# EAGLE design Interface_BAT (EAGLE 9.6.2)
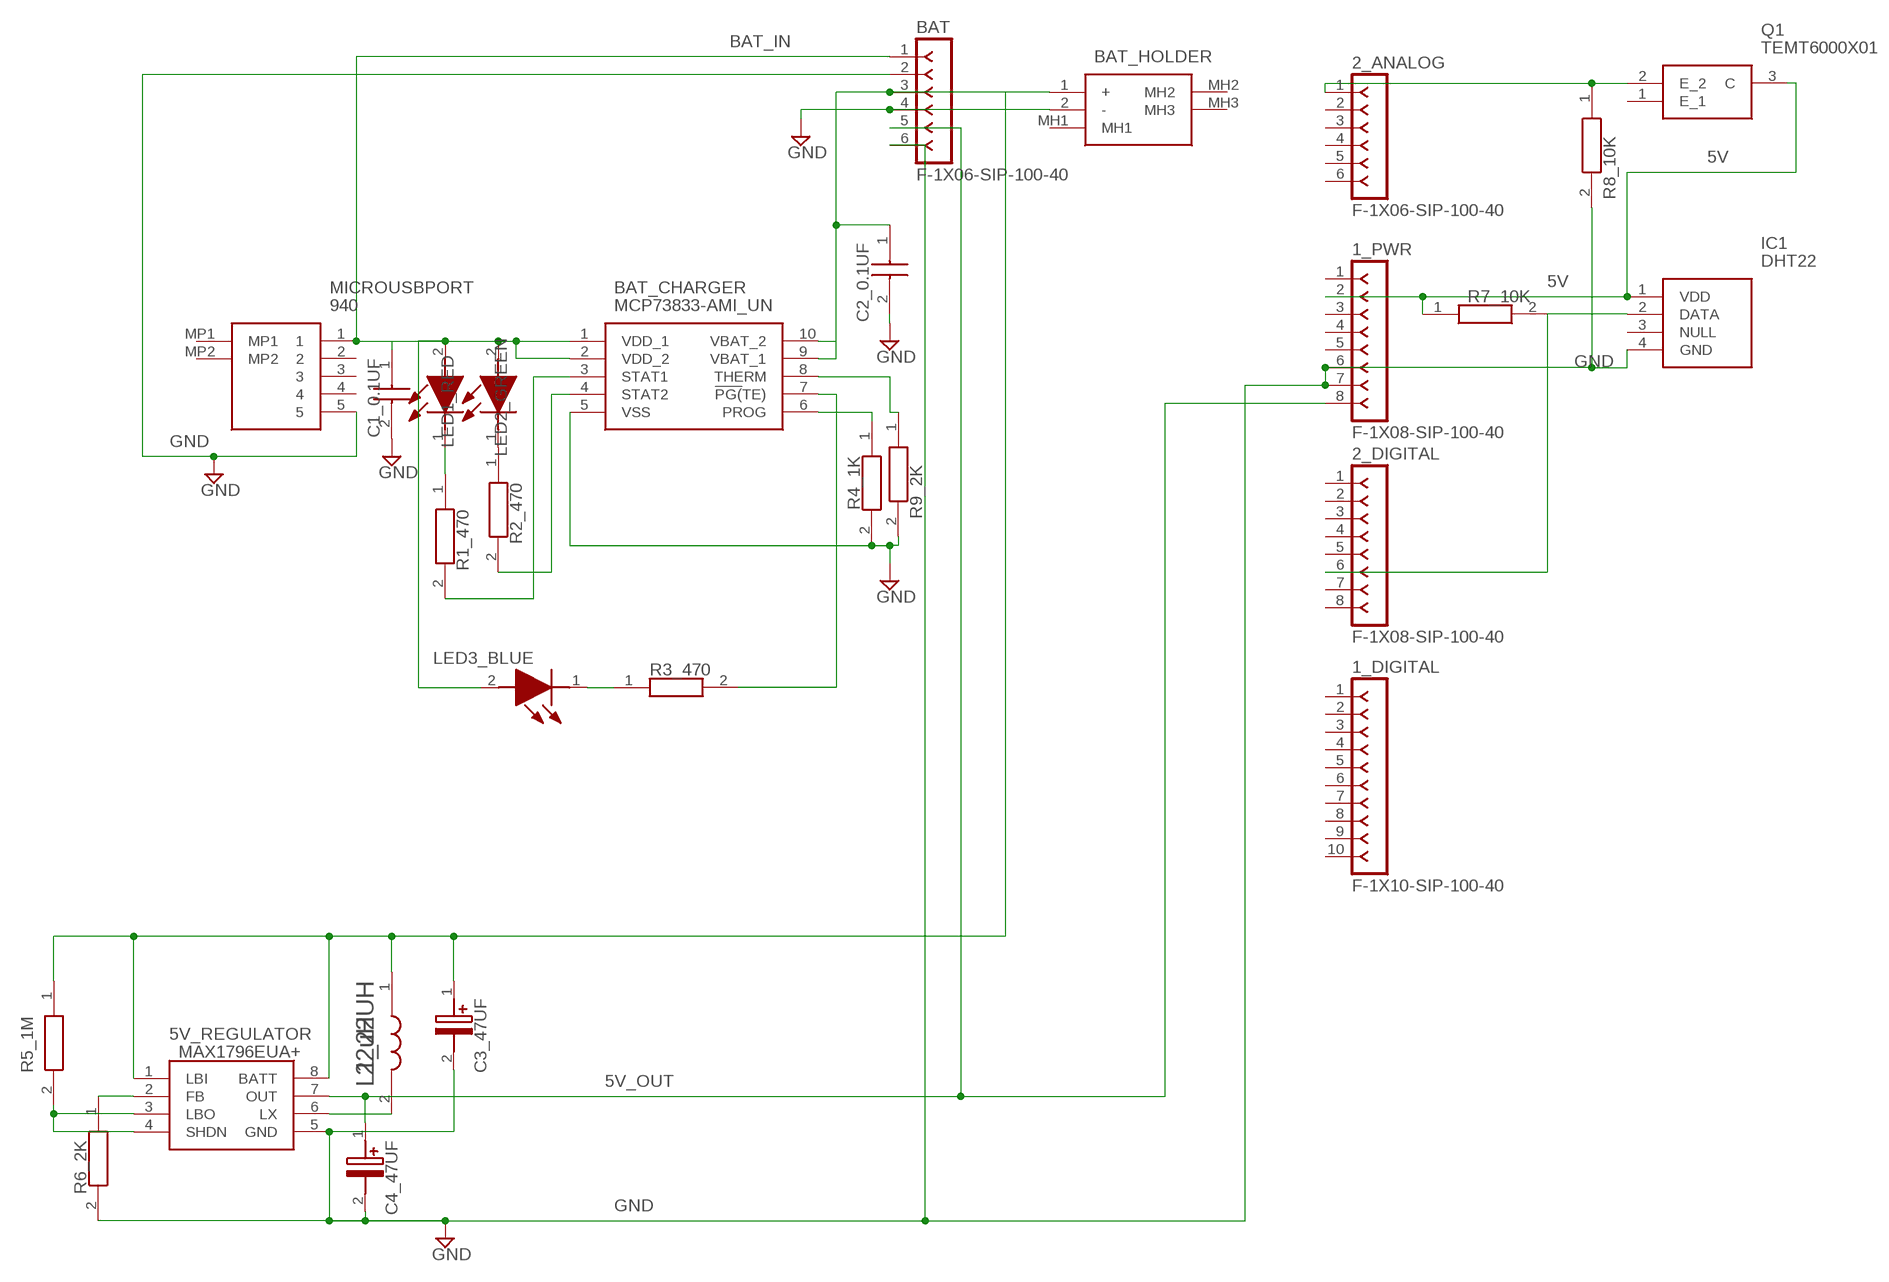
[diagram p0: schematic, sheet 1]

## Parts
1_DIGITAL  F-1X10-SIP-100-40  [SIP-100-10-40]
1_PWR  F-1X08-SIP-100-40  [SIP-100-08-40]
2_ANALOG  F-1X06-SIP-100-40  [SIP-100-06-40]
2_DIGITAL  F-1X08-SIP-100-40  [SIP-100-08-40]
5V_REGULATOR  MAX1796EUA+  [SOP65P490X110-8N]
BAT  F-1X06-SIP-100-40  [SIP-100-06-40]
BAT_CHARGER  MCP73833-AMI_UN  [SOP50P490X110-10N]
BAT_HOLDER  1043  [1043]
C1_0.1UF  C0805C104J5RACTU  [CAPC2012X88N]
C2_0.1UF  C0805C104J5RACTU  [CAPC2012X88N]
C3_47UF  10TPB47M  [CAPPM3528X210N]
C4_47UF  10TPB47M  [CAPPM3528X210N]
IC1  DHT22  [DHT22]
L1_22UH  COILCRAFT_LPS4018-223MRBCOILCRAFT_LPS4018-223MRB_0_0  [COILCRAFT_LPS4018-223MRB_0]
LED1_RED  KP-2012CGCK  [LEDC2012X110N]
LED2_GREEN  KP-2012CGCK  [LEDC2012X110N]
LED3_BLUE  KP-2012CGCK  [LEDC2012X110N]
MICROUSBPORT  940  [940]
Q1  TEMT6000X01  [TEMT6000X01]
R1_470  CRCW0805470RFKEA  [RESC2012X50N]
R2_470  CRCW0805470RFKEA  [RESC2012X50N]
R3_470  CRCW0805470RFKEA  [RESC2012X50N]
R4_1K  CRCW08051K00FKEA  [RESC2012X50N]
R5_1M  ERA6AEB105V  [RESC2012X60N]
R6_2K  CRCW08052K00FKEA  [RESC2012X50N]
R7_10K  ERJ6GEYJ103V  [RESC2012X70N]
R8_10K  ERJ6GEYJ103V  [RESC2012X70N]
R9_2K  CRCW08052K00FKEA  [RESC2012X50N]

## Nets
5V: 1_PWR.2 IC1.1(VDD) Q1.3(C) R7_10K.1
5V_OUT: 1_PWR.8 5V_REGULATOR.7(OUT) BAT.5 C4_47UF.1(+)
BAT_IN: BAT.1 BAT_CHARGER.1(VDD_1) BAT_CHARGER.2(VDD_2) C1_0.1UF.1 LED1_RED.2(A) LED2_GREEN.2(A) LED3_BLUE.2(A) MICROUSBPORT.1
GND: 1_PWR.6 1_PWR.7 5V_REGULATOR.5(GND) BAT.2 BAT.4 BAT.6 BAT_CHARGER.5(VSS) BAT_HOLDER.2(-) C1_0.1UF.2 C2_0.1UF.2 C3_47UF.2(-) C4_47UF.2(-) IC1.4(GND) MICROUSBPORT.5 R4_1K.2 R6_2K.2 R8_10K.2 R9_2K.2
N$1: 5V_REGULATOR.1(LBI) 5V_REGULATOR.8(BATT) BAT.3 BAT_CHARGER.9(VBAT_1) BAT_CHARGER.10(VBAT_2) BAT_HOLDER.1(+) C2_0.1UF.1 C3_47UF.1(+) L1_22UH.1 R5_1M.1
N$2: LED1_RED.1(K) R1_470.1
N$3: LED2_GREEN.1(K) R2_470.1
N$4: BAT_CHARGER.7(!PG(!TE)) R3_470.2
N$5: BAT_CHARGER.4(STAT2) R2_470.2
N$6: BAT_CHARGER.6(PROG) R4_1K.1
N$7: BAT_CHARGER.3(STAT1) R1_470.2
N$8: LED3_BLUE.1(K) R3_470.1
N$9: 5V_REGULATOR.3(LBO) 5V_REGULATOR.4(SHDN) R5_1M.2
N$10: BAT_CHARGER.8(THERM) R9_2K.1
N$11: 5V_REGULATOR.2(FB) R6_2K.1
N$12: 5V_REGULATOR.6(LX) L1_22UH.2
N$14: 2_DIGITAL.6 IC1.2(DATA) R7_10K.2
N$16: 2_ANALOG.1 Q1.2(E_2) R8_10K.1
Unconnected: 1_DIGITAL.1 1_DIGITAL.2 1_DIGITAL.3 1_DIGITAL.4 1_DIGITAL.5 1_DIGITAL.6 1_DIGITAL.7 1_DIGITAL.8 1_DIGITAL.9 1_DIGITAL.10 1_PWR.1 1_PWR.3 1_PWR.4 1_PWR.5 2_ANALOG.2 2_ANALOG.3 2_ANALOG.4 2_ANALOG.5 2_ANALOG.6 2_DIGITAL.1 2_DIGITAL.2 2_DIGITAL.3 2_DIGITAL.4 2_DIGITAL.5 2_DIGITAL.7 2_DIGITAL.8 BAT_HOLDER.MH1 BAT_HOLDER.MH2 BAT_HOLDER.MH3 IC1.3(NULL) MICROUSBPORT.2 MICROUSBPORT.3 MICROUSBPORT.4 MICROUSBPORT.MP1 MICROUSBPORT.MP2 Q1.1(E_1)

## Library data of the parts
1_DIGITAL = con-headers-jp-6pins:F-1X10-: FEMALE HEADER
1_PWR = con-headers-jp-6pins:F-1X08-: FEMALE HEADER
2_ANALOG BAT = con-headers-jp-6pins:F-1X06-: FEMALE HEADER
2_DIGITAL = con-headers-jp-8pins:F-1X08-: FEMALE HEADER
5V_REGULATOR = MAX1796EUA+:MAX1796EUA+: MAX1796EUA+, DC-DC Converter, 300mA Adjustable/Fixed 2 5.5 V, Step Up, 8-Pin uMAX Source: Datasheet <http://docs-emea.rs-online.com/webdocs/0f63/0900766b80f632ac.pdf>; DESCRIPTION: MAX1796EUA+, DC-DC Converter, 300mA Adjustable/Fixed 2 5.5 V, Step Up, 8-Pin uMAX; HEIGHT: 1.1mm; MANUFACTURER_NAME: Maxim Integrated; MANUFACTURER_PART_NUMBER: MAX1796EUA+; MOUSER_PART_NUMBER: 700-MAX1796EUA; MOUSER_PRICE-STOCK: https://www.mouser.co.uk/ProductDetail/Maxim-Integrated/MAX1796EUA%2b/?qs=1THa7WoU59G%2FzSCi6e3nvg%3D%3D
BAT_CHARGER = MCP73833-AMI_UN:MCP73833-AMI_UN: Microchip MCP73833-AMI/UN, Battery Charge Controller Lithium-Ion, Lithium-Polymer, 10-Pin MSOP Source: Datasheet <http://componentsearchengine.com/Datasheets/1/MCP73833-AMI_UN.pdf>; ARROW_PART_NUMBER: MCP73833-AMI/UN; ARROW_PRICE-STOCK: https://www.arrow.com/en/products/mcp73833-amiun/microchip-technology; DESCRIPTION: Microchip MCP73833-AMI/UN, Battery Charge Controller Lithium-Ion, Lithium-Polymer, 10-Pin MSOP; HEIGHT: 1.1mm; MANUFACTURER_NAME: Microchip; MANUFACTURER_PART_NUMBER: MCP73833-AMI/UN; MOUSER_PART_NUMBER: 579-MCP73833-AMI/UN; MOUSER_PRICE-STOCK: https://www.mouser.co.uk/ProductDetail/Microchip-Technology/MCP73833-AMI-UN/?qs=Fxu3fLyJv8fd%2FGnsUSC9lg%3D%3D
BAT_HOLDER = 1043:1043: KEYSTONE - 1043 - BATTERY HOLDER, 18650, TH Source: Datasheet <http://www.keyelco.com/product-pdf.cfm?p=919>; DESCRIPTION: KEYSTONE - 1043 - BATTERY HOLDER, 18650, TH; HEIGHT: 14.86mm; MANUFACTURER_NAME: Keystone Electronics; MANUFACTURER_PART_NUMBER: 1043; MOUSER_PART_NUMBER: 534-1043; MOUSER_PRICE-STOCK: https://www.mouser.co.uk/ProductDetail/Keystone-Electronics/1043/?qs=%2F7TOpeL5Mz6j%2FnxeOA1rsg%3D%3D
C1_0.1UF C2_0.1UF = C0805C104J5RACTU:C0805C104J5RACTU: Kemet 100nF +/-5% 50 V dc X7R Dielectric SMD Ceramic Multilayer Capacitor 0805 Source: Datasheet <http://www.kemet.com/docfinder?Partnumber=C0805C104J5RACTU.pdf>; ARROW_PART_NUMBER: C0805C104J5RACTU; ARROW_PRICE-STOCK: https://www.arrow.com/en/products/c0805c104j5ractu/kemet-corporation; DESCRIPTION: Kemet 100nF +/-5% 50 V dc X7R Dielectric SMD Ceramic Multilayer Capacitor 0805; HEIGHT: 0.88mm; MANUFACTURER_NAME: Kemet; MANUFACTURER_PART_NUMBER: C0805C104J5RACTU; MOUSER_PART_NUMBER: 80-C0805C104J5R; MOUSER_PRICE-STOCK: https://www.mouser.co.uk/ProductDetail/KEMET/C0805C104J5RACTU/?qs=gbgtKHXraGH15GhoNPXHBg%3D%3D
C3_47UF C4_47UF = 10TPB47M:10TPB47M: Panasonic Tantalum Capacitor 47uF 10V dc Polymer Solid +/-20% Tolerance POSCAP TPB Series Source: Datasheet <https://www.mouser.com/datasheet/2/315/AAA8000C65-1150039.pdf>; ARROW_PART_NUMBER: 10TPB47M; ARROW_PRICE-STOCK: https://www.arrow.com/en/products/10tpb47m/panasonic; DESCRIPTION: Panasonic Tantalum Capacitor 47uF 10V dc Polymer Solid +/-20% Tolerance POSCAP TPB Series; HEIGHT: 2.1mm; MANUFACTURER_NAME: Panasonic; MANUFACTURER_PART_NUMBER: 10TPB47M; MOUSER_PART_NUMBER: 667-10TPB47M; MOUSER_PRICE-STOCK: https://www.mouser.co.uk/ProductDetail/Panasonic/10TPB47M/?qs=OE1iw1LrrPF6e38T0%252BNoyw%3D%3D
IC1 = DHT22:DHT22: Digital-output relative humidity & temperature sensor/module DHT22 Source: Datasheet <https://datasheet4u.com/datasheet-parts/DHT22-datasheet.php?id=792211>; DESCRIPTION: Digital-output relative humidity & temperature sensor/module DHT22; HEIGHT: 25.1mm; MANUFACTURER_NAME: Aosong Electronics; MANUFACTURER_PART_NUMBER: DHT22
L1_22UH = Coilcraft - LPS4018-223MRB:COILCRAFT_LPS4018-223MRB: Power inductor, shielded, 20/30% tol, SMT, RoHS, lead-free, halogen-free; AMBIENT_TEMPERATURE_RANGE_HIGH: +85°C; AMBIENT_TEMPERATURE_RANGE_LOW: -40°C; AUTOMOTIVE: Yes; AUTOMOTIVE_GRADE: Grade 3; CENTROID_NOT_SPECIFIED: No; CORE_MATERIAL: Ferrite; DATASHEET: https://www.coilcraft.com/pdfs/lps4018.pdf; DEVICE_CLASS_L1: Passive Components; DEVICE_CLASS_L2: Inductors; DEVICE_CLASS_L3: Fixed Inductors; FOOTPRINT_VARIANT_NAME_0: Recommended_Land_Pattern; HEIGHT: 1.8mm; INDUCTANCE: 22uH; LEAD_FREE: Yes; MF: Coilcraft; MFG_PACKAGE_IDENT: LPS4018; MFG_PACKAGE_IDENT_DATE: 0; MFG_PACKAGE_IDENT_REV: 0; MOUSER_DESCRIPTION: Power inductor, shielded, 20/30% tol, SMT, RoHS, lead-free, halogen-free; MOUSER_PART_NUMBER: 994-LPS4018-223MRB; MPN: LPS4018-223MRB; PACKAGE: SMT_IND_3MM9_3MM9; PREFIX: L; RMS_CURRENT: 0.9A; ROHS: Yes; SATURATION_CURRENT: 0.8A; SELF_RESONANT_FREQUENCY: 26MHz; SERIES_RESISTANCE: 0.36Ω; SHIELDING: true; TEST_FREQUENCY: 1MHz; TOLERANCE: 20%; VERIFICATION_VERSION: 0.0.0.3
LED1_RED LED2_GREEN LED3_BLUE = KP-2012CGCK:KP-2012CGCK: Green Chip LED 2.0x1.25mm Kingbright KP-2012CGCK Green LED, 570 nm, 2012 (0805), Rectangle Lens SMD Package Source: Datasheet <https://componentsearchengine.com/Datasheets/2/KP-2012CGCK.pdf>; ARROW_PART_NUMBER: KP-2012CGCK; ARROW_PRICE-STOCK: https://www.arrow.com/en/products/kp-2012cgck/kingbright; DESCRIPTION: Green Chip LED 2.0x1.25mm Kingbright KP-2012CGCK Green LED, 570 nm, 2012 (0805), Rectangle Lens SMD Package; HEIGHT: 1.1mm; MANUFACTURER_NAME: Kingbright; MANUFACTURER_PART_NUMBER: KP-2012CGCK; MOUSER_PART_NUMBER: N/A; MOUSER_PRICE-STOCK: https://www.mouser.co.uk/ProductDetail/Kingbright/KP-2012CGCK?qs=2JU0tDl2GZ3tjMUbXin2qw%3D%3D
MICROUSBPORT = 940:940: USB Connectors Micro USB SMT Jack Source: Datasheet <http://www.keyelco.com/product-pdf.cfm?p=2866>; DESCRIPTION: USB Connectors Micro USB SMT Jack; HEIGHT: 3mm; MANUFACTURER_NAME: Keystone Electronics; MANUFACTURER_PART_NUMBER: 940; MOUSER_PART_NUMBER: 534-940; MOUSER_PRICE-STOCK: https://www.mouser.co.uk/ProductDetail/Keystone-Electronics/940?qs=yVzmszbBh58hdhxDnSDHfg%3D%3D
Q1 = TEMT6000X01:TEMT6000X01: Ambient Light Sensor 570nm SMD3 Vishay TEMT6000X01 +/-60 Visible Light Phototransistor, Surface Mount 3-Pin 1206 package Source: Datasheet <https://www.vishay.com/docs/81579/temt6000.pdf>; ARROW_PART_NUMBER: TEMT6000X01; ARROW_PRICE-STOCK: https://www.arrow.com/en/products/temt6000x01/vishay; DESCRIPTION: Ambient Light Sensor 570nm SMD3 Vishay TEMT6000X01 +/-60 Visible Light Phototransistor, Surface Mount 3-Pin 1206 package; HEIGHT: mm; MANUFACTURER_NAME: Vishay; MANUFACTURER_PART_NUMBER: TEMT6000X01; MOUSER_PART_NUMBER: 78-TEMT6000; MOUSER_PRICE-STOCK: https://www.mouser.co.uk/ProductDetail/Vishay-Semiconductors/TEMT6000X01/?qs=%2Fjqivxn91ccZGXDwz0wGxg%3D%3D
R1_470 R2_470 R3_470 = CRCW0805470RFKEA:CRCW0805470RFKEA: Vishay CRCW Series Thick Film Surface Mount Resistor 0805 Case 470 +/-1% 0.125W +/-100ppm/C Source: Datasheet <http://www.vishay.com/docs/20035/dcrcwe3.pdf>; ARROW_PART_NUMBER: CRCW0805470RFKEA; ARROW_PRICE-STOCK: https://www.arrow.com/en/products/crcw0805470rfkea/vishay; DESCRIPTION: Vishay CRCW Series Thick Film Surface Mount Resistor 0805 Case 470 +/-1% 0.125W +/-100ppm/C; HEIGHT: 0.5mm; MANUFACTURER_NAME: Vishay; MANUFACTURER_PART_NUMBER: CRCW0805470RFKEA; MOUSER_PART_NUMBER: 71-CRCW0805-470-E3; MOUSER_PRICE-STOCK: https://www.mouser.co.uk/ProductDetail/Vishay-Dale/CRCW0805470RFKEA?qs=H9nSDuxQXAFXsHHWFcTSWg%3D%3D
R4_1K = CRCW08051K00FKEA:CRCW08051K00FKEA: Vishay CRCW Series Thick Film Surface Mount Resistor 0805 Case 1k +/-1% 0.125W +/-100ppm/C Source: Datasheet <http://www.vishay.com/docs/20035/dcrcwe3.pdf>; ARROW_PART_NUMBER: CRCW08051K00FKEA; ARROW_PRICE-STOCK: https://www.arrow.com/en/products/crcw08051k00fkea/vishay; DESCRIPTION: Vishay CRCW Series Thick Film Surface Mount Resistor 0805 Case 1k +/-1% 0.125W +/-100ppm/C; HEIGHT: 0.5mm; MANUFACTURER_NAME: Vishay; MANUFACTURER_PART_NUMBER: CRCW08051K00FKEA; MOUSER_PART_NUMBER: 71-CRCW0805-1.0K-E3; MOUSER_PRICE-STOCK: https://www.mouser.co.uk/ProductDetail/Vishay-Dale/CRCW08051K00FKEA/?qs=DZvKvnD5UYU3bClwFPa9DQ%3D%3D
R5_1M = ERA6AEB105V:ERA6AEB105V: SMD Thin film resistor 0805 1M (Reel) Panasonic ERA Series Thin Film Surface Mount Fixed Resistor 0805 Case 1M +/-0.1% 0.125W +/-25ppm/C Source: Datasheet <https://industrial.panasonic.com/cdbs/www-data/pdf/RDM0000/AOA0000C307.pdf>; DESCRIPTION: SMD Thin film resistor 0805 1M (Reel) Panasonic ERA Series Thin Film Surface Mount Fixed Resistor 0805 Case 1M +/-0.1% 0.125W +/-25ppm/C; HEIGHT: 0.6mm; MANUFACTURER_NAME: Panasonic; MANUFACTURER_PART_NUMBER: ERA6AEB105V
R6_2K R9_2K = CRCW08052K00FKEA:CRCW08052K00FKEA: Thick Film;Res 2 K; 0.125 W; 1%;SMT Vishay CRCW Series Thick Film Surface Mount Resistor 0805 Case 2k +/-1% 0.33W +/-100ppm/K Source: Datasheet <http://www.vishay.com/docs/20035/dcrcwe3.pdf>; ARROW_PART_NUMBER: CRCW08052K00FKEA; ARROW_PRICE-STOCK: https://www.arrow.com/en/products/crcw08052k00fkea/vishay; DESCRIPTION: Thick Film;Res 2 K; 0.125 W; 1%;SMT Vishay CRCW Series Thick Film Surface Mount Resistor 0805 Case 2k +/-1% 0.33W +/-100ppm/K; HEIGHT: 0.5mm; MANUFACTURER_NAME: Vishay; MANUFACTURER_PART_NUMBER: CRCW08052K00FKEA; MOUSER_PART_NUMBER: 71-CRCW0805-2.0K-E3; MOUSER_PRICE-STOCK: https://www.mouser.co.uk/ProductDetail/Vishay-Dale/CRCW08052K00FKEA?qs=SM0pg8AlB3rAI09HcwFYKg%3D%3D
R7_10K R8_10K = ERJ6GEYJ103V:ERJ6GEYJ103V: Panasonic ERJ6GE Series Thick Film Surface Mount Fixed Resistor 0805 Case 10k +/-5% 0.125W +/-200ppm/C Source: Datasheet <http://docs-europe.electrocomponents.com/webdocs/13ba/0900766b813ba21b.pdf>; DESCRIPTION: Panasonic ERJ6GE Series Thick Film Surface Mount Fixed Resistor 0805 Case 10k +/-5% 0.125W +/-200ppm/C; HEIGHT: 0.7mm; MANUFACTURER_NAME: Panasonic; MANUFACTURER_PART_NUMBER: ERJ6GEYJ103V

## Board
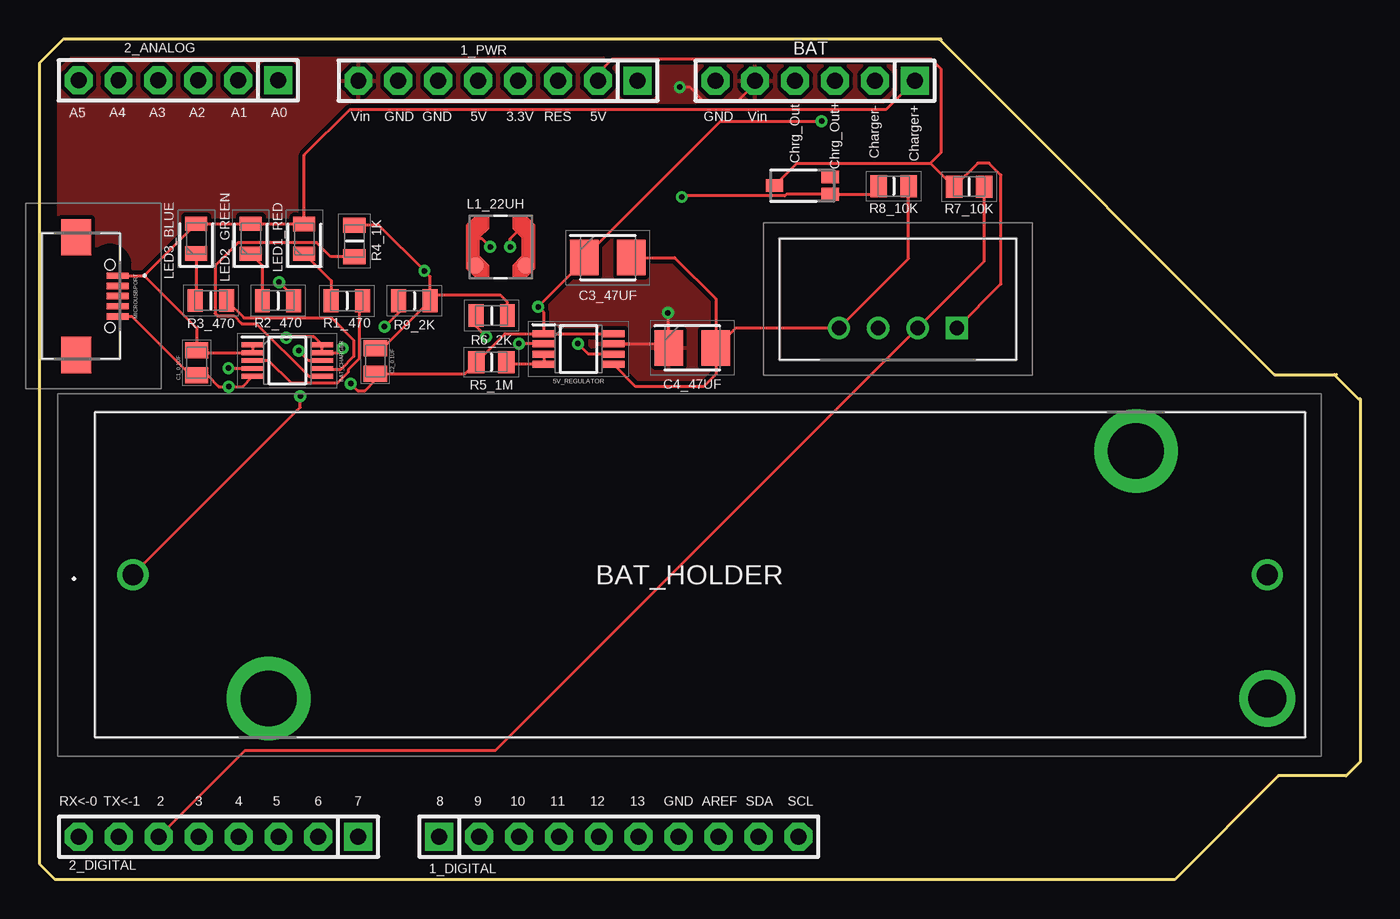
[diagram p1: board, top side]
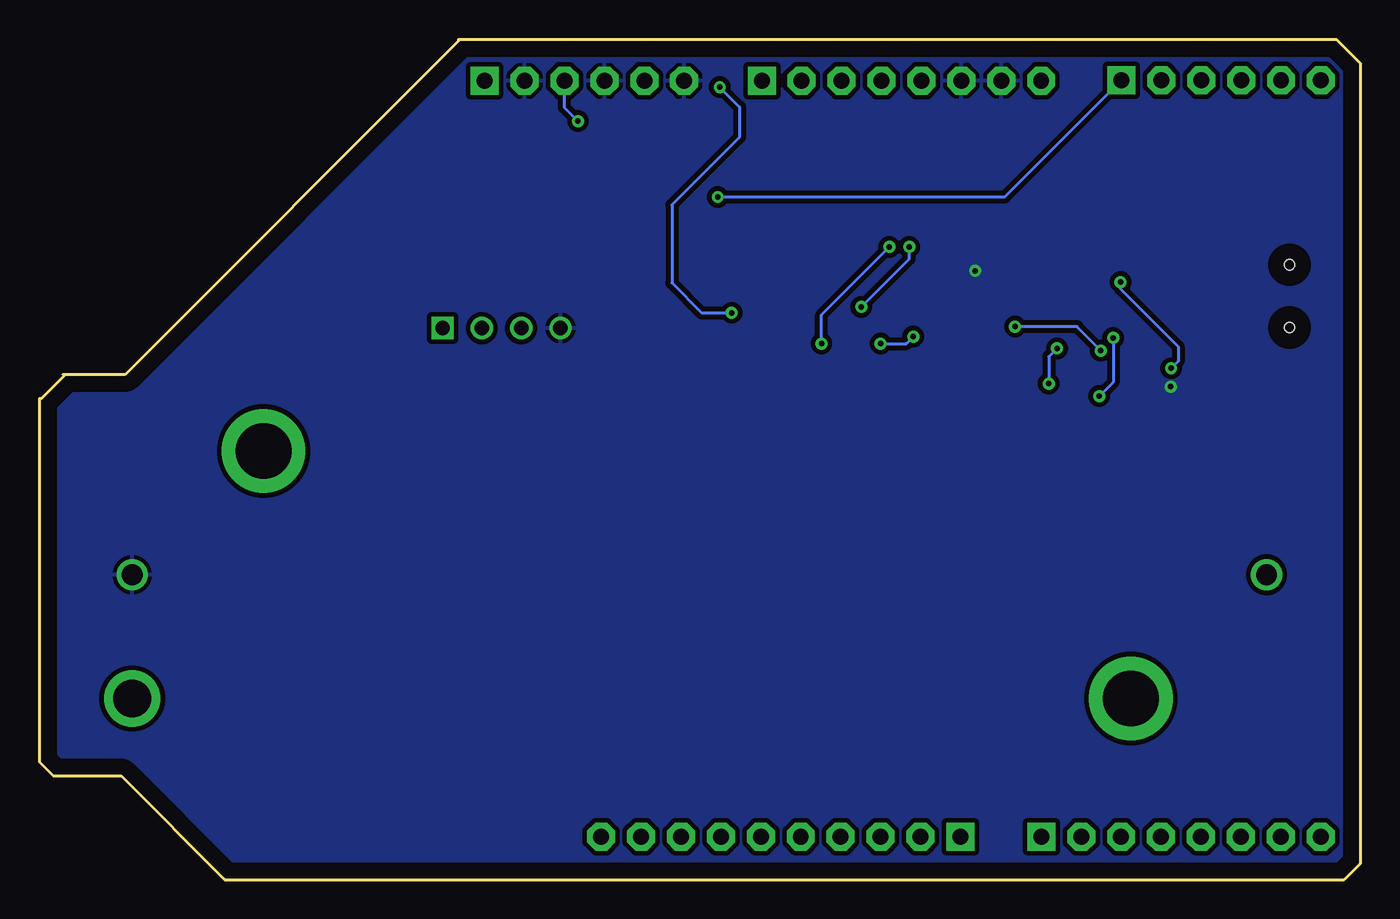
[diagram p2: board, bottom side, seen from below]

Size 84.07 x 53.47 mm. Coordinates in mm from the lower left corner, seen from the top.
Outline: 57.28,53.47 78.61,32.13 82.42,32.13
Outline: 82.42,32.13 82.55,32.13
Outline: 82.42,32.13 83.95,30.61 84.07,30.61 84.07,7.49 83.19,6.6 78.87,6.6 72.26,0 1.02,0 0,1.02 0,51.94 1.52,53.47 57.4,53.47
Copper layers (1*16): Top 0.035mm / dielectric 1.5mm / Bottom 0.035mm
Design rules "default": minimum track width 6mil, minimum drill 0.35mm, track to track 6mil, track to pad 6mil, pad to pad 6mil, via to via 6mil, smd to smd 6mil, copper to edge 40mil, drill to drill 6mil, minimum pad ring 10mil, minimum via ring 8mil, stop-mask expansion 4mil, vias tented up to drill 0mil, thermal gap 10mil

### Footprints (pad centres in the part's own frame; a part is rotated, then mirrored left to right if it is on the bottom)
SIP-100-10-40 = drill 1.016 pad 1.778 square: 1 -11.43,0 | drill 1.016 pad 1.778 octagon: 2 -8.89,0; 3 -6.35,0; 4 -3.81,0; 5 -1.27,0; 6 1.27,0; 7 3.81,0; 8 6.35,0; 9 8.89,0; 10 11.43,0
SIP-100-08-40 = drill 1.016 pad 1.778 square: 1 -8.89,0 | drill 1.016 pad 1.778 octagon: 2 -6.35,0; 3 -3.81,0; 4 -1.27,0; 5 1.27,0; 6 3.81,0; 7 6.35,0; 8 8.89,0
SIP-100-06-40 = drill 1.016 pad 1.778 square: 1 -6.35,0 | drill 1.016 pad 1.778 octagon: 2 -3.81,0; 3 -1.27,0; 4 1.27,0; 5 3.81,0; 6 6.35,0
SOP65P490X110-8N = smd 1.425 x 0.45: 1 -2.212,0.975; 2 -2.212,0.325; 3 -2.212,-0.325; 4 -2.212,-0.975; 5 2.212,-0.975; 6 2.212,-0.325; 7 2.212,0.325; 8 2.212,0.975
SOP50P490X110-10N = smd 1.4 x 0.3: 1 -2.2,1; 2 -2.2,0.5; 3 -2.2,0; 4 -2.2,-0.5; 5 -2.2,-1; 6 2.2,-1; 7 2.2,-0.5; 8 2.2,0; 9 2.2,0.5; 10 2.2,1
1043 = drill 1.32 pad 1.98: 1 0,0; 2 72.2,0 | drill 3.55 pad 5.325: MH1 8.64,-7.87; MH3 63.84,7.87 | drill 2.39 pad 3.585: MH2 72.2,-7.87
CAPC2012X88N = smd 1.02 x 1.47: 1 -0.8,0; 2 0.8,0
CAPPM3528X210N = smd 1.8 x 2.25: 1 -1.5,0; 2 1.5,0
DHT22 = drill 0.91 pad 1.416 square: 1 0,0 | drill 0.91 pad 1.416: 2 2.5,0; 3 5,0; 4 7.5,0
COILCRAFT_LPS4018-223MRB_0 = smd 1.026 x 1.026: 1 -1.611,-1.175; 2 1.611,-1.175
LEDC2012X110N = smd 0.9 x 1.4: 1 -0.95,0; 2 0.95,0
940 = smd 0.4 x 1.4: 1 -1.3,2.35; 2 -0.65,2.35; 3 0,2.35; 4 0.65,2.35; 5 1.3,2.35 | smd 2.3 x 1.9: MP1 -3.75,-0.3; MP2 3.75,-0.3 | hole 0.65: -2,1.85; 2,1.85
TEMT6000X01 = smd 1.1 x 0.8: 1 -1.775,-0.55; 2 -1.775,0.55; 3 1.775,0
RESC2012X50N = smd 0.95 x 1.45: 1 -1,0; 2 1,0
RESC2012X60N = smd 1.05 x 1.4: 1 -0.95,0; 2 0.95,0
RESC2012X70N = smd 1.05 x 1.4: 1 -0.95,0; 2 0.95,0

### Placement (x,y rotation side)
1_DIGITAL  36.88,2.74 0 top
1_PWR  29.2,50.84 180 top
2_ANALOG  8.85,50.86 180 top
2_DIGITAL  11.41,2.73 180 top
5V_REGULATOR  34.33,33.76 0 top
BAT  49.38,50.83 180 top
BAT_CHARGER  15.79,33.03 0 top
BAT_HOLDER  5.96,19.4 0 top
C1_0.1UF  10.02,32.89 270 top
C2_0.1UF  21.39,33 90 top
C3_47UF  36.18,39.57 0 top
C4_47UF  41.56,33.83 0 top
IC1  58.4,35.09 180 top
L1_22UH  29.37,40.26 0 top
LED1_RED  16.87,40.77 90 top
LED2_GREEN  13.46,40.78 90 top
LED3_BLUE  10,40.79 90 top
MICROUSBPORT  2.65,37.13 270 top
Q1  48.56,44.16 180 top
R1_470  19.58,36.83 0 top
R2_470  15.2,36.84 0 top
R3_470  10.92,36.85 0 top
R4_1K  20.06,40.64 90 top
R5_1M  28.78,32.93 0 top
R6_2K  28.79,35.89 0 top
R7_10K  59.18,44.09 0 top
R8_10K  54.38,44.12 0 top
R9_2K  23.88,36.83 0 top

### Tracks (layer width: path | path; a pad name or v marks a point on that pad's centre or on a via)
5V
  Top 0.203: 56.73,45.59 R7_10K.1 59.73,45.59 60.45,45.59 61.21,44.83 61.21,37.9 IC1.1 | Q1.3 48.23,45.59 56.73,45.59 | 56.73,45.59 57.4,46.27 57.4,51.56 56.77,52.2 36.45,52.2 35.56,51.31 35.56,50.96 35.55,50.95 1_PWR.2
5V_OUT  (via drill 0.35)
  Top 0.203: BAT.5 45.57,50.65 44.45,49.53 42.29,49.53 41.4,50.42 v40.77,50.42 | 5V_REGULATOR.7 39.8,34.09 C4_47UF.1 40.01,33.89 v40.01,36.07
  Bottom 0.203: v40.77,50.42 39.5,49.15 39.5,47.24 43.81,42.93 43.81,37.97 41.91,36.07 v40.01,36.07
  pour Top (isolate 0.254): 1.65,53.21 57.15,53.21 57.28,53.09 78.49,31.88 82.3,31.88 83.82,30.35 83.82,7.62 83.06,6.86 78.74,6.86 72.14,0.25 1.14,0.25 0.25,1.14 0.25,51.82
BAT_IN
  Top 0.203: MICROUSBPORT.1 6.69,38.43 | 6.69,38.43 LED3_BLUE.2 16.85,41.74 LED1_RED.2 | LED1_RED.2 16.87,46.11 19.76,49 53.9,49 BAT.1 | 6.69,38.43 10.02,35.1 C1_0.1UF.1 10.18,33.53 BAT_CHARGER.2 BAT_CHARGER.1 | LED2_GREEN.2 LED1_RED.2
GND  (via drill 0.35)
  Top 0.203: MICROUSBPORT.5 5.9,35.83 9.64,32.09 C1_0.1UF.2 10.71,32.09 11.43,31.37 v12.06,31.37 12.93,31.37 BAT_CHARGER.5 | C2_0.1UF.2 21.84,33.8 R9_2K.2 | R9_2K.2 24.88,38.37 v24.51,38.73 21.61,41.64 R4_1K.2 | R9_2K.2 25.26,37.21 29.34,37.21 29.79,36.76 R6_2K.2 | R8_10K.2 55.33,39.52 IC1.4 44.33,35.09 C4_47UF.2 | C4_47UF.2 43.06,32.14 42.29,31.37 37.96,31.37 5V_REGULATOR.5 | C3_47UF.2 40.44,39.57 43.06,36.95 C4_47UF.2
  pour Bottom (isolate 0.305): 1.65,53.21 57.15,53.21 57.53,52.83 78.49,31.88 79.12,31.88 82.3,31.88 83.82,30.35 83.82,7.62 83.57,7.37 83.06,6.86 78.74,6.86 72.14,0.25 70.99,0.25 1.14,0.25 0.25,1.14 0.25,51.82
N$1  (via drill 0.35)
  Top 0.203: BAT_HOLDER.1 16.61,30.05 v16.61,30.76 | v15.72,34.47 15.79,34.54 17.48,34.54 BAT_CHARGER.10 BAT_CHARGER.9 19.02,33.53 v19.3,33.81 | v19.83,31.56 20.27,31.11 20.73,31.11 21.39,31.78 C2_0.1UF.1 27.09,32.2 R5_1M.1 29.64,34.74 5V_REGULATOR.1 | 5V_REGULATOR.1 32.11,36.09 v31.75,36.45 34.68,39.38 C3_47UF.1 43.37,48.26 v49.78,48.26 | 5V_REGULATOR.1 5V_REGULATOR.8 | v28.7,40.26 28.19,40.77 27.81,40.77 27.81,39.14 L1_22UH.1
  Bottom 0.203: v15.72,34.47 15.72,31.65 v16.61,30.76 | v19.3,33.81 19.83,33.28 v19.83,31.56 | v31.75,36.45 28.7,39.5 v28.7,40.26 | v49.78,48.26 50.65,49.12 BAT.3
N$2
  Top 0.203: LED1_RED.1 18.58,38.11 R1_470.1
N$3
  Top 0.203: LED2_GREEN.1 14.2,39.09 R2_470.1
N$4
  Top 0.203: R3_470.2 13.03,35.74 18.59,35.74 20.02,34.32 20.02,33.3 19.2,32.49 18.59,32.49 18.55,32.53 BAT_CHARGER.7
N$5  (via drill 0.35)
  Top 0.203: v12.04,32.54 BAT_CHARGER.4 | v15.26,38.02 16.2,37.08 R2_470.2
  Bottom 0.203: v12.04,32.54 11.58,33 11.58,33.91 15.26,37.58 v15.26,38.02
N$6
  Top 0.203: R4_1K.1 18.56,39.64 17.66,40.53 12.65,40.53 11.19,39.07 11.19,36.02 11.34,35.87 12.4,35.87 12.88,35.38 13.82,35.38 17.17,32.03 BAT_CHARGER.6
N$7
  Top 0.203: R1_470.2 20.37,36.62 20.37,33.15 19.66,32.44 19.66,32.28 18.95,31.57 16.05,31.57 14.6,33.03 BAT_CHARGER.3
N$8
  Top 0.203: LED3_BLUE.1 10,36.93 R3_470.1
N$9
  Top 0.203: 5V_REGULATOR.3 5V_REGULATOR.4 29.87,32.79 R5_1M.2
N$10  (via drill 0.35)
  Top 0.203: BAT_CHARGER.8 17.14,33.03 v16.51,33.66 | v21.97,35.18 22.88,36.08 R9_2K.1
  Bottom 0.203: v16.51,33.66 18.03,35.18 v21.97,35.18
N$11  (via drill 0.35)
  Top 0.203: 5V_REGULATOR.2 30.55,34.09 v30.53,34.11 | v28.45,34.54 27.79,35.2 R6_2K.1
  Bottom 0.203: v30.53,34.11 28.89,34.11 v28.45,34.54
N$12  (via drill 0.35)
  Top 0.203: 5V_REGULATOR.6 34.96,33.44 v34.29,34.11 | v29.97,40.26 29.97,40.77 30.54,41.34 30.98,40.9 L1_22UH.2
  Bottom 0.203: v34.29,34.11 34.29,35.94 v29.97,40.26
N$14
  Top 0.203: 2_DIGITAL.6 13.1,8.23 29.04,8.23 IC1.2 60.13,39.32 R7_10K.2
N$16  (via drill 0.35)
  Top 0.203: R8_10K.1 52.92,43.61 Q1.2 47.55,43.61 47.45,43.5 40.96,43.5 v40.89,43.43
  Bottom 0.203: v40.89,43.43 22.62,43.43 2_ANALOG.1

### Text on the board
tNames: Charger- | Charger+ | A5 | A4 | A3 | A2 | A1 | A0 | Vin | GND | GND | 5V | 3.3V | RES | 5V | GND | Vin | Chrg_Out- | Chrg_Out+ | RX<-0 | TX<-1 | 2 | 3 | 4 | 5 | 6 | 7 | 8 | 9 | 10 | 11 | 12 | 13 | GND | AREF | SDA | SCL